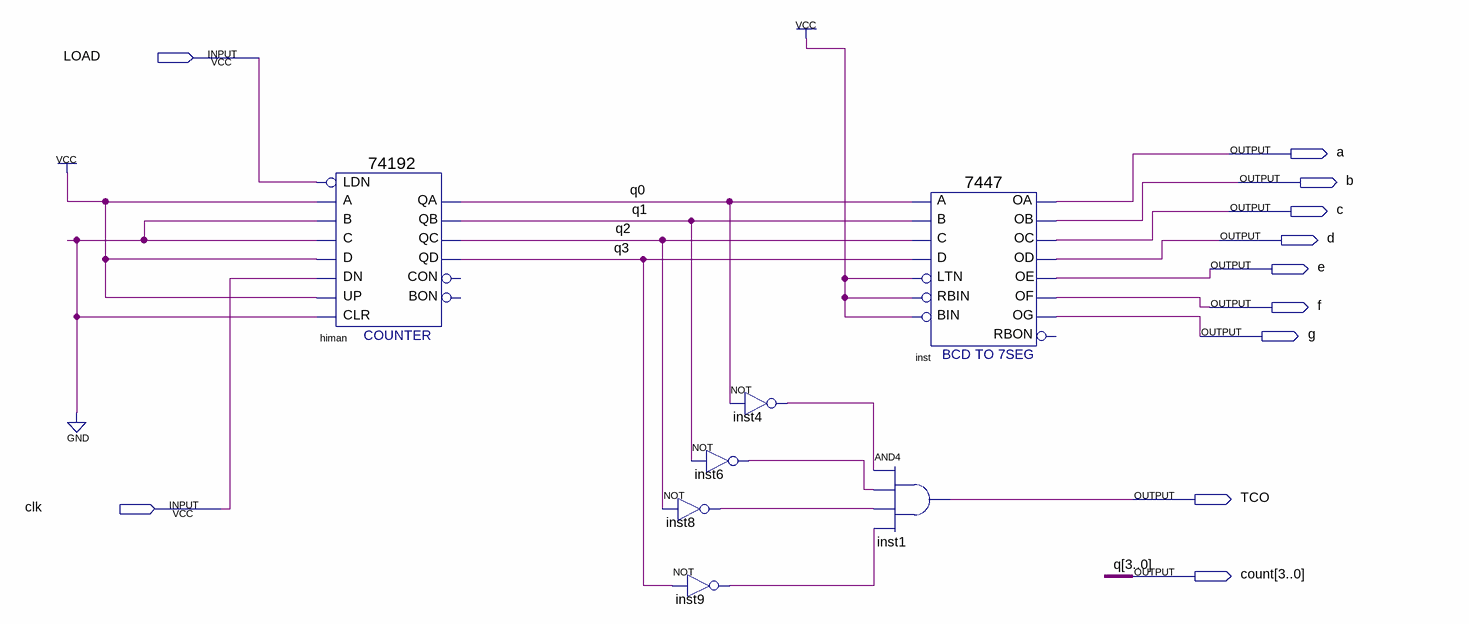
[diagram p0: schematic sheet]
// Quartus schematic firstweekprelab.bdf as structural Verilog: 7 symbols, 11 pins
module firstweekprelab (
  input  LOAD,
  input  clk,
  output a,
  output b,
  output c,
  output d,
  output e,
  output f,
  output g,
  output TCO,
  output [3:0] count
);

  wire inst4_out, inst6_out, inst8_out, inst9_out;

  \74192  himan (
    .D(1'b1), .C(1'b0), .A(1'b1), .B(1'b0), .CLR(1'b0), .UP(1'b1), .DN(clk), .LDN(LOAD), .QB(count[1]),
    .QA(count[0]), .QC(count[2]), .QD(count[3]));  // open: BON, CON
  not inst8 (inst8_out, count[2]);
  not inst4 (inst4_out, count[0]);
  not inst6 (inst6_out, count[1]);
  not inst9 (inst9_out, count[3]);
  and inst1 (TCO, inst4_out, inst6_out, inst8_out, inst9_out);
  \7447  inst (
    .LTN(1'b1), .B(count[1]), .C(count[2]), .D(count[3]), .RBIN(1'b1), .BIN(1'b1), .A(count[0]), .OB(b),
    .OC(c), .OE(e), .OD(d), .OF(f), .OG(g), .OA(a));  // open: RBON

  // Other names for the same wires on the sheet: q[3:0] = count; q0 = count[0]; q1 = count[1]; q2 = count[2];
  //   q3 = count[3]
endmodule
